# EAGLE design FET1 (EAGLE 6.5.0)
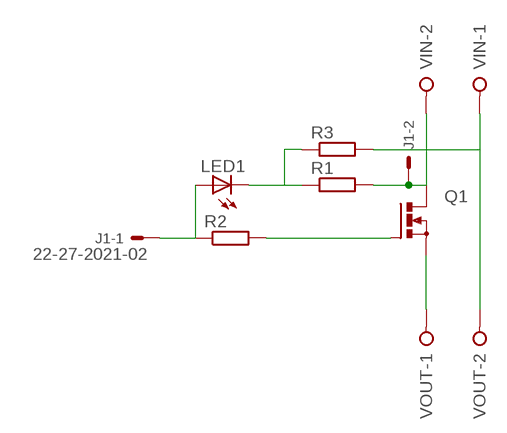
[diagram p0: schematic, sheet 1]

## Parts
J1  22-27-2021-02  [6410-02]
LED1  LED5MM  [LED5MM]
Q1  PMOSFET_NTO220BV  [TO220BV]
R1  R-EU_0207/7  [0207/7]
R2  R-EU_0207/7  [0207/7]
R3  R-EU_0207/7  [0207/7]
VIN  W237-02P  [W237-132]
VOUT  W237-02P  [W237-132]

## Nets
GIN: J1.2 Q1.D R1.2 VIN.2
GOUT: Q1.S VOUT.1
N$1: Q1.G R2.2
N$5: LED1.K(C) R1.1 R3.1
N$6: J1.1 LED1.A R2.1
V+: R3.2 VIN.1 VOUT.2

## Library data of the parts
J1 = con-molex:22-?-02: CONNECTOR wire to board 2.54 mm (.1 inch) pitch header; OC_FARNELL: unknown; OC_NEWARK: unknown
LED1 = led:LED: LED OSRAM: - CHIPLED LG R971, LG N971, LY N971, LG Q971, LY Q971, LO R971, LY R971 LH N974, LH R974 LS Q976, LO Q976, LY Q976 LO Q996 - Hyper CHIPLED LW Q18S LB Q993, LB Q99A, LB R99A - SideLED LS A670, LO A670, LY A670, LG A670, LP A670 LB A673, LV A673, LT A673, LW A673 LH A674 LY A675 LS A676, LA A676, LO A676, LY A676, LW A676 LS A679, LY A679, LG A679 - Hyper Micro SIDELED® LS Y876, LA Y876, LO Y876, LY Y876 LT Y87S - SmartLED LW L88C, LW L88S LB L89C, LB L89S, LG L890 LS L89K, LO L89K, LY L89K LS L896, LA L896, LO L896, LY L896 - TOPLED LS T670, LO T670, LY T670, LG T670, LP T670 LSG T670, LSP T670, LSY T670, LOP T670, LYG T670 LG T671, LOG T671, LSG T671 LB T673, LV T673, LT T673, LW T673 LH T674 LS T676, LA T676, LO T676, LY T676, LB T676, LH T676, LSB T676, LW T676 LB T67C, LV T67C, LT T67C, LS T67K, LO T67K, LY T67K, LW E67C LS E67B, LA E67B, LO E67B, LY E67B, LB E67C, LV E67C, LT E67C LW T67C LS T679, LY T679, LG T679 LS T770, LO T770, LY T770, LG T770, LP T770 LB T773, LV T773, LT T773, LW T773 LH T774 LS E675, LA E675, LY E675, LS T675 LS T776, LA T776, LO T776, LY T776, LB T776 LHGB T686 LT T68C, LB T68C - Hyper Mini TOPLED® LB M676 - Mini TOPLED Santana® LG M470 LS M47K, LO M47K, LY M47K Source: http://www.osram.convergy.de LUXEON: - LUMILED® LXK2-PW12-R00, LXK2-PW12-S00, LXK2-PW14-U00, LXK2-PW14-V00 LXK2-PM12-R00, LXK2-PM12-S00, LXK2-PM14-U00 LXK2-PE12-Q00, LXK2-PE12-R00, LXK2-PE12-S00, LXK2-PE14-T00, LXK2-PE14-U00 LXK2-PB12-K00, LXK2-PB12-L00, LXK2-PB12-M00, LXK2-PB14-N00, LXK2-PB14-P00, LXK2-PB14-Q00 LXK2-PR12-L00, LXK2-PR12-M00, LXK2-PR14-Q00, LXK2-PR14-R00 LXK2-PD12-Q00, LXK2-PD12-R00, LXK2-PD12-S00 LXK2-PH12-R00, LXK2-PH12-S00 LXK2-PL12-P00, LXK2-PL12-Q00, LXK2-PL12-R00 Source: www.luxeon.com KINGBRIGHT: KA-3528ASYC Source: www.kingbright.com
Q1 = transistor-power:PMOSFET_N: Power MOSFET N-Channel
R1-R3 = rcl:R-EU_: RESISTOR, European symbol
VIN VOUT = con-wago-508:W237-02P: WAGO SREW CLAMP; OC_FARNELL: unknown; OC_NEWARK: unknown

## Board
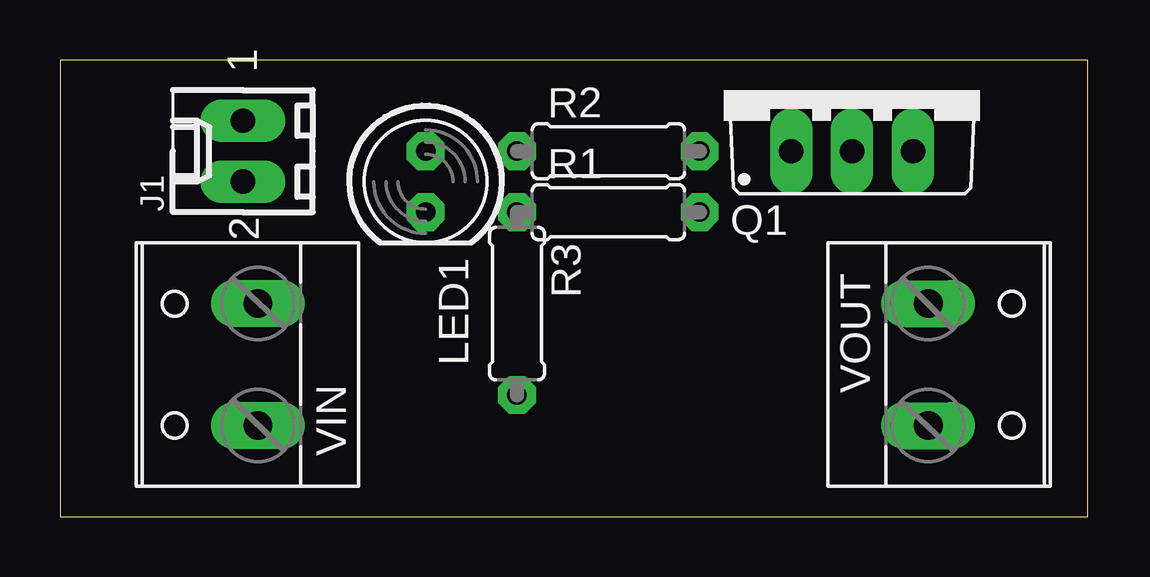
[diagram p1: board, top side]
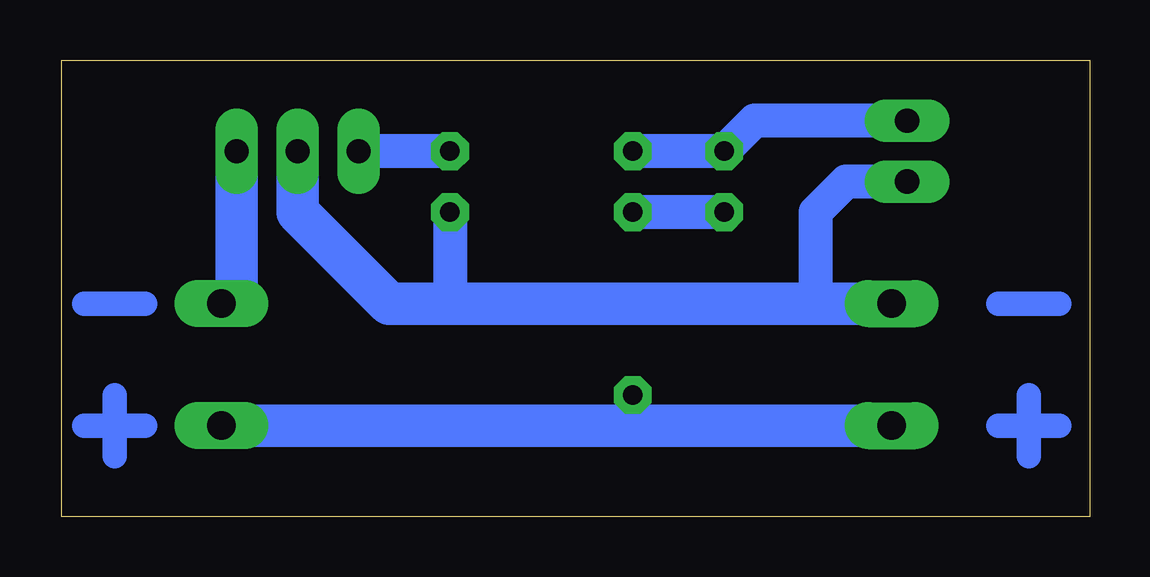
[diagram p2: board, bottom side, seen from below]

Size 42.85 x 19.04 mm. Coordinates in mm from the lower left corner, seen from the top.
Outline: 0,0 42.85,0 42.85,19.04 0,19.04 0,0
Copper layers (1*16): Top 0.035mm / dielectric 1.5mm / Bottom 0.035mm
Design rules "homepcb": minimum track width 10mil, minimum drill 20mil, track to track 10mil, track to pad 10mil, pad to pad 10mil, via to via 10mil, smd to smd 10mil, copper to edge 40mil, drill to drill 10mil, minimum pad ring 15mil, minimum via ring 10mil, stop-mask expansion 0mil, vias tented up to drill 0mil, thermal gap 10mil

### Footprints (pad centres in the part's own frame; a part is rotated, then mirrored left to right if it is on the bottom)
6410-02 = drill 1.016 long: 1 1.27,0; 2 -1.27,0
LED5MM = drill 0.813 octagon: A -1.27,0; K 1.27,0
TO220BV = drill 1.016 long: D 0,-2.54; G -2.54,-2.54; S 2.54,-2.54
0207/7 = drill 0.813 octagon: 1 -3.81,0; 2 3.81,0
W237-132 = drill 1.194 long: 1 -2.54,-0.635; 2 2.54,-0.635

### Placement (x,y rotation side)
J1  7.62,15.24 90 top
LED1  15.24,13.97 270 top
Q1  33.02,17.78 0 top
R1  22.86,12.7 0 top
R2  22.86,15.24 0 top
R3  19.05,8.89 270 top
VIN  7.62,6.35 90 top
VOUT  36.83,6.35 270 top

### Tracks (layer width: path | path; a pad name or v marks a point on that pad's centre or on a via)
GIN
  Bottom 1.422: R1.2 26.67,8.89 | J1.2 10.16,13.97 11.43,12.7 11.43,8.89
  Bottom 1.778: VIN.2 11.43,8.89 26.67,8.89 29.21,8.89 33.02,12.7 Q1.D
GOUT
  Bottom 1.778: Q1.S 35.56,9.53 VOUT.1
N$1
  Bottom 1.422: R2.2 Q1.G
N$2
  Bottom 1.016: 2.54,5.08 2.54,2.54
N$3
  Bottom 1.016: 1.27,3.81 3.81,3.81
N$4
  Bottom 1.016: 1.27,8.89 3.81,8.89
N$5
  Bottom 1.422: LED1.K R3.1
N$6
  Bottom 1.422: J1.1 13.97,16.51 LED1.A R2.1
N$7
  Bottom 1.016: 39.37,8.89 41.91,8.89
N$8
  Bottom 1.016: 39.37,3.81 41.91,3.81
N$9
  Bottom 1.016: 40.64,5.08 40.64,2.54
V+
  Bottom 1.422: R3.2 19.05,3.81
  Bottom 1.778: VIN.1 19.05,3.81 VOUT.2